# EAGLE design driver_ANNOTATED (EAGLE 8.0.0)
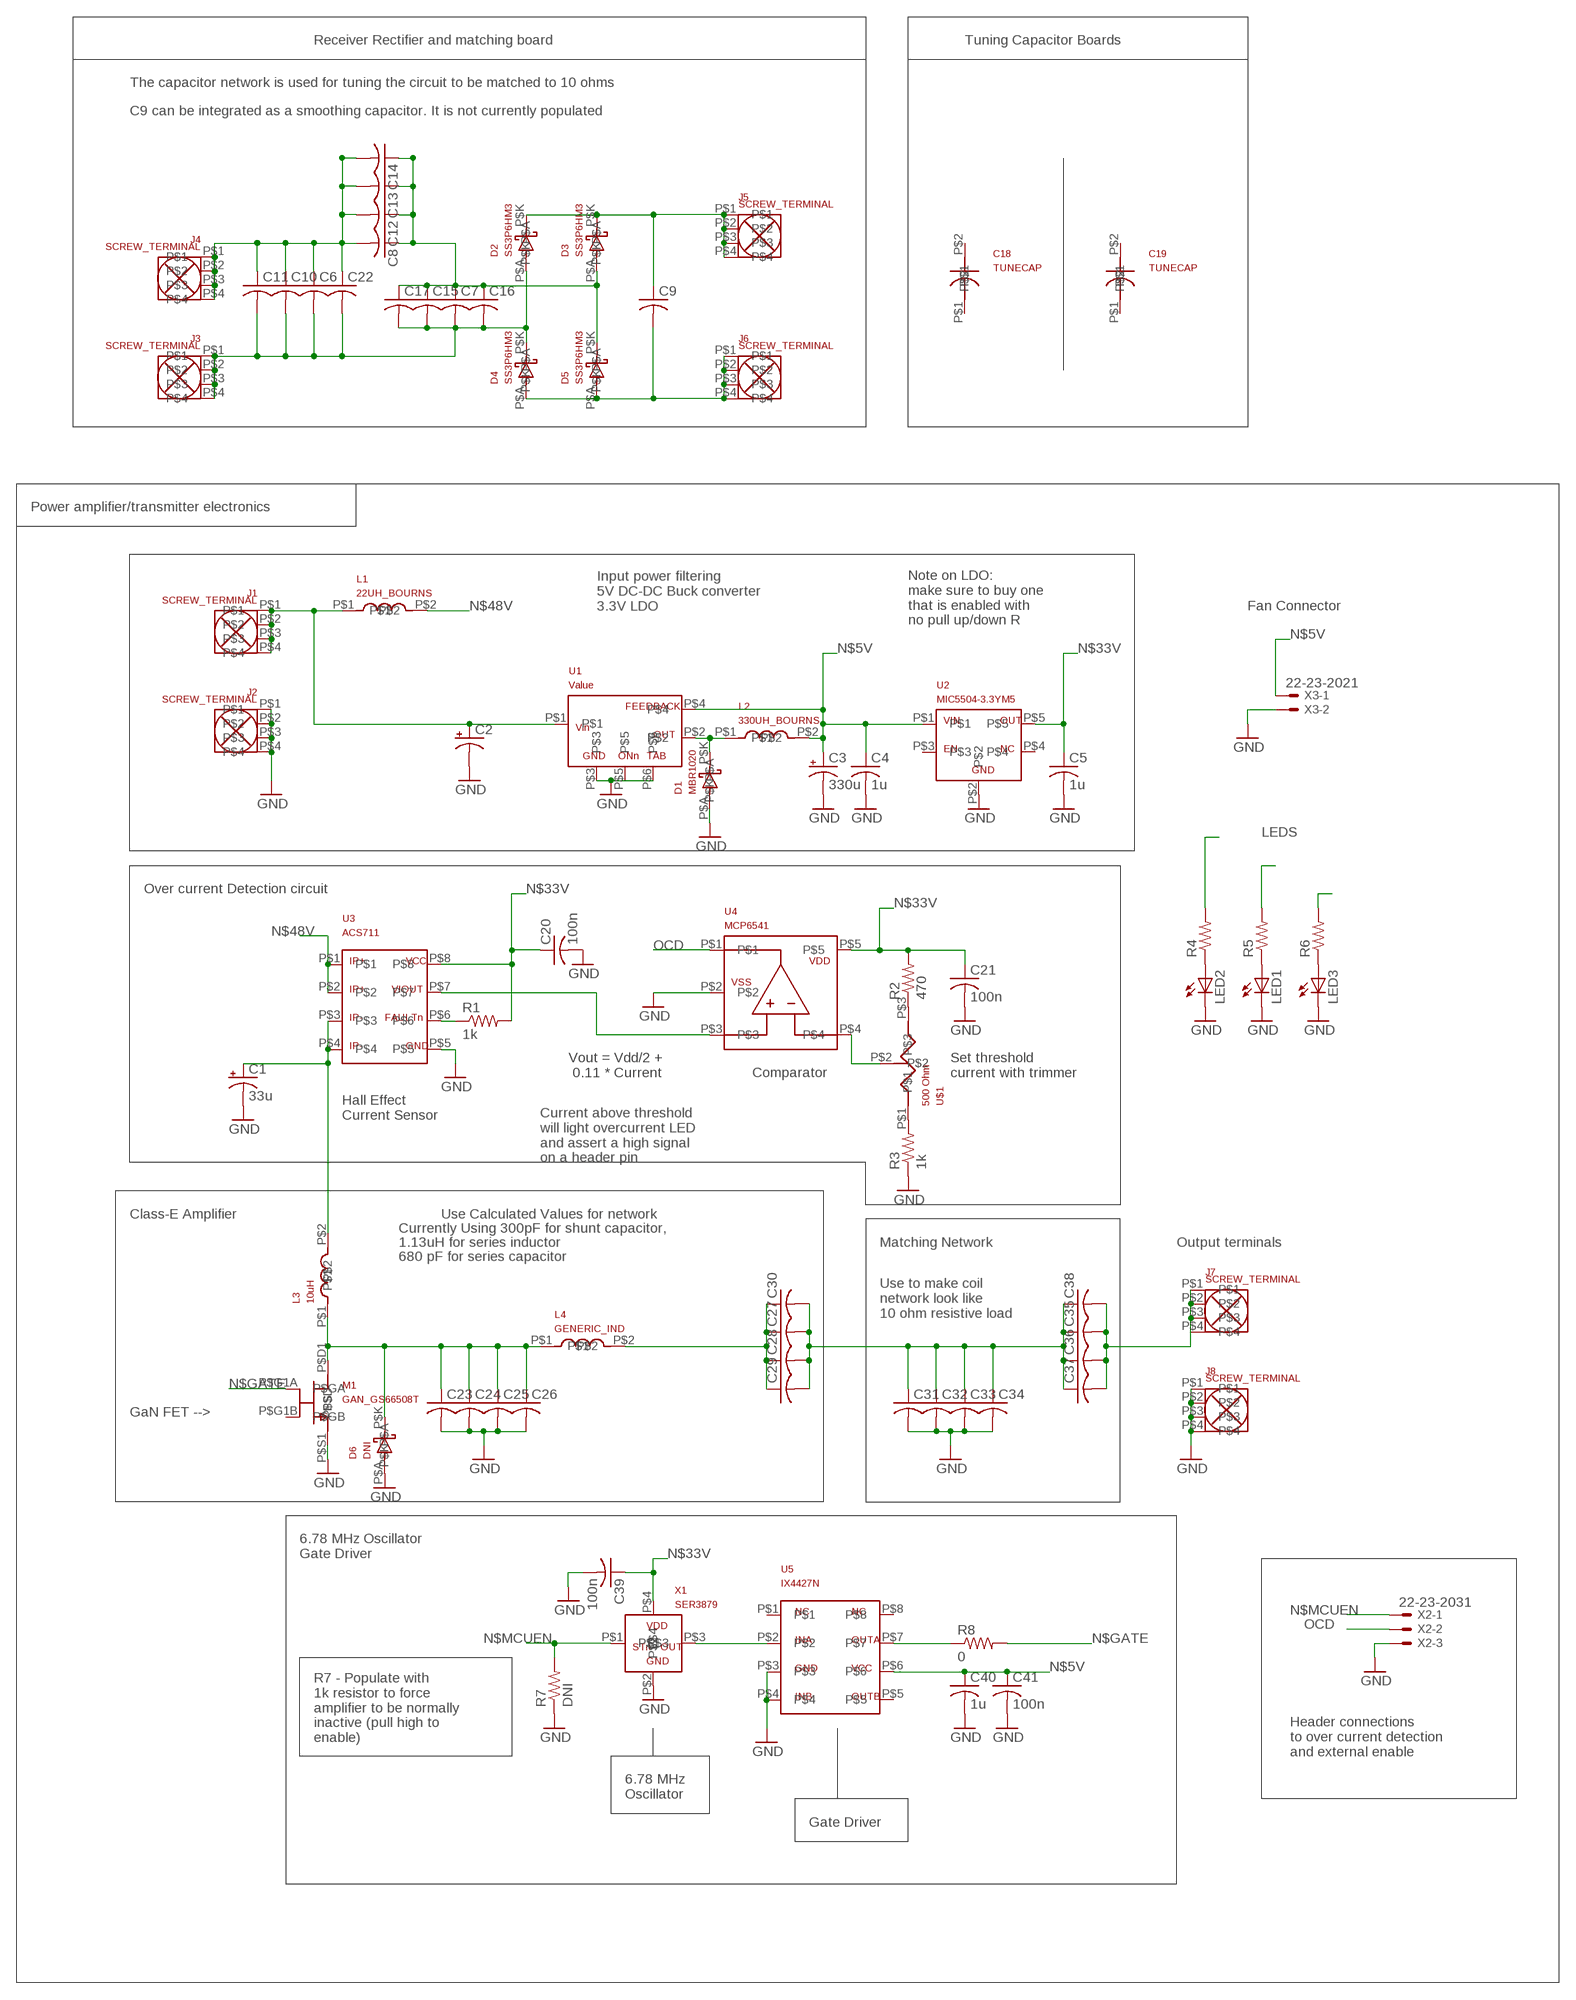
[diagram p0: schematic, sheet 1]

## Parts
C1  33u  CPOL-US140CLH-0810  [140CLH-0810]
C2  CPOL-US140CLH-1010  [140CLH-1010]
C3  330u  CPOL-US150CLZ-0810  [150CLZ-0810]
C4  1u  C-USC0603K  [C0603K]
C5  1u  C-USC0603K  [C0603K]
C6  C-USC1206K  [C1206K]
C7  C-USC1206K  [C1206K]
C8  C-USC1206K  [C1206K]
C9  C-USC1206K  [C1206K]
C10  C-USC1206K  [C1206K]
C11  C-USC1206K  [C1206K]
C12  C-USC1206K  [C1206K]
C13  C-USC1206K  [C1206K]
C14  C-USC1206K  [C1206K]
C15  C-USC1206K  [C1206K]
C16  C-USC1206K  [C1206K]
C17  C-USC1206K  [C1206K]
C18  TUNECAP  [CAPTUNE]
C19  TUNECAP  [CAPTUNE]
C20  100n  C-USC0603  [C0603]
C21  100n  C-USC0603K  [C0603K]
C22  C-USC1206K  [C1206K]
C23  C-USC1206K  [C1206K]
C24  C-USC1206K  [C1206K]
C25  C-USC1206K  [C1206K]
C26  C-USC1206K  [C1206K]
C27  C-USC1206K  [C1206K]
C28  C-USC1206K  [C1206K]
C29  C-USC1206K  [C1206K]
C30  C-USC1206K  [C1206K]
C31  C-USC1206K  [C1206K]
C32  C-USC1206K  [C1206K]
C33  C-USC1206K  [C1206K]
C34  C-USC1206K  [C1206K]
C35  C-USC1206K  [C1206K]
C36  C-USC1206K  [C1206K]
C37  C-USC1206K  [C1206K]
C38  C-USC1206K  [C1206K]
C39  100n  C-USC0603K  [C0603K]
C40  1u  C-USC0603K  [C0603K]
C41  100n  C-USC0603K  [C0603K]
D1  MBR1020  [SOD-123]
D2  SS3P6HM3  [D0-220]
D3  SS3P6HM3  [D0-220]
D4  SS3P6HM3  [D0-220]
D5  SS3P6HM3  [D0-220]
D6  DNI  SS3P6HM3  [D0-220]
J1  SCREW_TERMINAL  [SCREW_TERMINAL]
J2  SCREW_TERMINAL  [SCREW_TERMINAL]
J3  SCREW_TERMINAL  [SCREW_TERMINAL]
J4  SCREW_TERMINAL  [SCREW_TERMINAL]
J5  SCREW_TERMINAL  [SCREW_TERMINAL]
J6  SCREW_TERMINAL  [SCREW_TERMINAL]
J7  SCREW_TERMINAL  [SCREW_TERMINAL]
J8  SCREW_TERMINAL  [SCREW_TERMINAL]
L1  22UH_BOURNS  [492MIL_IND]
L2  330UH_BOURNS  [330U_IND]
L3  10uH  GENERIC_IND  [GENERIC_IND]
L4  GENERIC_IND  [GENERIC_IND]
LED1  LEDCHIPLED_0805  [CHIPLED_0805]
LED2  LEDCHIPLED_0805  [CHIPLED_0805]
LED3  LEDCHIPLED_0805  [CHIPLED_0805]
M1  GAN_GS66508T  [GAN_GS66508T]
R1  1k  R-US_R0603  [R0603]
R2  470  R-US_R0603  [R0603]
R3  1k  R-US_R0603  [R0603]
R4  R-US_R0603  [R0603]
R5  R-US_R0603  [R0603]
R6  R-US_R0603  [R0603]
R7  DNI  R-US_R0603  [R0603]
R8  0  R-US_R0603  [R0603]
U1  TL2575HV  [TL2575HV]
U2  MIC5504-3.3YM5  [MIC5504-3.3YM5]
U3  ACS711  [IX4427N]
U4  MCP6541  [SC-70-5]
U5  IX4427N  [IX4427N]
U$1  500 Ohm  TRIMMER  [TRIMMER]
X1  SER3879  [SER3879-ND]
X2  22-23-2031  [22-23-2031]
X3  22-23-2021  [22-23-2021]

## Nets
GND: C1.- C2.- C3.- C4.2 C5.2 C20.2 C21.2 C23.2 C24.2 C25.2 C26.2 C31.2 C32.2 C33.2 C34.2 C39.2 C40.2 C41.2 D1.P$A D6.P$A J2.P$1 J2.P$2 J2.P$3 J2.P$4 J8.P$1 J8.P$2 J8.P$3 J8.P$4 LED1.C LED2.C LED3.C M1.P$S1(P$S) R3.1 R7.1 U1.P$3 U1.P$5 U1.P$6 U2.P$2 U3.P$5 U4.P$2 U5.P$3 U5.P$4 X1.P$2 X2.3 X3.2
N$1: D1.P$K L2.P$1 U1.P$2
N$2: C2.+ J1.P$1 J1.P$2 J1.P$3 J1.P$4 L1.P$1 U1.P$1
N$3: C6.2 C7.2 C10.2 C11.2 C15.2 C16.2 C17.2 C22.2 D2.P$A D4.P$K J3.P$1 J3.P$2 J3.P$3 J3.P$4
N$4: C6.1 C8.2 C10.1 C11.1 C12.2 C13.2 C14.2 C22.1 J4.P$1 J4.P$2 J4.P$3 J4.P$4
N$5: C7.1 C8.1 C12.1 C13.1 C14.1 C15.1 C16.1 C17.1 D3.P$A D5.P$K
N$5V: C3.+ C4.1 C40.1 C41.1 L2.P$2 R4.2 U1.P$4 U2.P$1 U5.P$6 X3.1
N$6: C9.2 D4.P$A D5.P$A J6.P$1 J6.P$2 J6.P$3 J6.P$4
N$7: C9.1 D2.P$K D3.P$K J5.P$1 J5.P$2 J5.P$3 J5.P$4
N$8: C1.+ L3.P$2 U3.P$3 U3.P$4
N$9: U3.P$7 U4.P$3
N$10: R1.1 U3.P$6
N$11: R2.1 U$1.P$3
N$12: R3.2 U$1.P$1
N$14: U4.P$4 U$1.P$2
N$15: C23.1 C24.1 C25.1 C26.1 D6.P$K L3.P$1 L4.P$1 M1.P$D1(P$D)
N$16: C27.1 C28.1 C29.1 C30.1 L4.P$2
N$17: LED2.A R4.1
N$18: LED1.A R5.1
N$19: LED3.A R6.1
N$20: C27.2 C28.2 C29.2 C30.2 C31.1 C32.1 C33.1 C34.1 C35.1 C36.1 C37.1 C38.1
N$21: R8.1 U5.P$7
N$22: U5.P$2 X1.P$3
N$33V: C5.1 C20.1 C21.1 C39.1 R1.2 R2.2 U2.P$5 U3.P$8 U4.P$5 X1.P$4
N$36: C35.2 C36.2 C37.2 C38.2 J7.P$1 J7.P$2 J7.P$3 J7.P$4
N$48V: L1.P$2 U3.P$1 U3.P$2
N$GATE: M1.P$G1A(P$GA) R8.2
N$MCUEN: R6.2 R7.2 X1.P$1 X2.1
OCD: R5.2 U4.P$1 X2.2
Unconnected: C18.P$1 C18.P$2 C19.P$1 C19.P$2 M1.P$G1B(P$GB) U2.P$3 U2.P$4 U5.P$1 U5.P$5 U5.P$8

## Notes on the sheet
- Receiver Rectifier and matching board | Tuning Capacitor Boards
- The capacitor network is used for tuning the circuit to be matched to 10 ohms
- C9 can be integrated as a smoothing capacitor. It is not currently populated
- Power amplifier/transmitter electronics
- Input power filtering 
  5V DC-DC Buck converter
  3.3V LDO
- Fan Connector
- Note on LDO:
  make sure to buy one
  that is enabled with 
  no pull up/down R
- LEDS
- Over current Detection circuit
- Vout = Vdd/2 +
   0.11 * Current
- Comparator
- Set threshold 
  current with trimmer
- Hall Effect 
  Current Sensor
- Current above threshold
  will light overcurrent LED
  and assert a high signal
  on a header pin
- Class-E Amplifier | Use Calculated Values for network
- Currently Using 300pF for shunt capacitor,
- 1.13uH for series inductor | Matching Network | Output terminals
- 680 pF for series capacitor
- Use to make coil
  network look like
  10 ohm resistive load
- GaN FET -->
- 6.78 MHz Oscillator
  Gate Driver
- R7 - Populate with
  1k resistor to force
  amplifier to be normally
  inactive (pull high to 
  enable)
- Header connections
  to over current detection
  and external enable
- 6.78 MHz 
  Oscillator
- Gate Driver

## Library data of the parts
C1-C3 = rcl:CPOL-US: POLARIZED CAPACITOR, American symbol
C4-C17 C20-C41 = rcl:C-US: CAPACITOR, American symbol
C18 C19 = wpt:TUNECAP
D1 = wpt:MBR1020
D2-D6 = wpt:SS3P6HM3
J1-J8 = wpt:SCREW_TERMINAL
L1 = wpt:22UH_BOURNS
L2 = wpt:330UH_BOURNS
L3 L4 = wpt:GENERIC_IND
LED1-LED3 = led:LED: LED OSRAM: - CHIPLED LG R971, LG N971, LY N971, LG Q971, LY Q971, LO R971, LY R971 LH N974, LH R974 LS Q976, LO Q976, LY Q976 LO Q996 - Hyper CHIPLED LW Q18S LB Q993, LB Q99A, LB R99A - SideLED LS A670, LO A670, LY A670, LG A670, LP A670 LB A673, LV A673, LT A673, LW A673 LH A674 LY A675 LS A676, LA A676, LO A676, LY A676, LW A676 LS A679, LY A679, LG A679 - Hyper Micro SIDELED® LS Y876, LA Y876, LO Y876, LY Y876 LT Y87S - SmartLED LW L88C, LW L88S LB L89C, LB L89S, LG L890 LS L89K, LO L89K, LY L89K LS L896, LA L896, LO L896, LY L896 - TOPLED LS T670, LO T670, LY T670, LG T670, LP T670 LSG T670, LSP T670, LSY T670, LOP T670, LYG T670 LG T671, LOG T671, LSG T671 LB T673, LV T673, LT T673, LW T673 LH T674 LS T676, LA T676, LO T676, LY T676, LB T676, LH T676, LSB T676, LW T676 LB T67C, LV T67C, LT T67C, LS T67K, LO T67K, LY T67K, LW E67C LS E67B, LA E67B, LO E67B, LY E67B, LB E67C, LV E67C, LT E67C LW T67C LS T679, LY T679, LG T679 LS T770, LO T770, LY T770, LG T770, LP T770 LB T773, LV T773, LT T773, LW T773 LH T774 LS E675, LA E675, LY E675, LS T675 LS T776, LA T776, LO T776, LY T776, LB T776 LHGB T686 LT T68C, LB T68C - Hyper Mini TOPLED® LB M676 - Mini TOPLED Santana® LG M470 LS M47K, LO M47K, LY M47K Source: http://www.osram.convergy.de LUXEON: - LUMILED® LXK2-PW12-R00, LXK2-PW12-S00, LXK2-PW14-U00, LXK2-PW14-V00 LXK2-PM12-R00, LXK2-PM12-S00, LXK2-PM14-U00 LXK2-PE12-Q00, LXK2-PE12-R00, LXK2-PE12-S00, LXK2-PE14-T00, LXK2-PE14-U00 LXK2-PB12-K00, LXK2-PB12-L00, LXK2-PB12-M00, LXK2-PB14-N00, LXK2-PB14-P00, LXK2-PB14-Q00 LXK2-PR12-L00, LXK2-PR12-M00, LXK2-PR14-Q00, LXK2-PR14-R00 LXK2-PD12-Q00, LXK2-PD12-R00, LXK2-PD12-S00 LXK2-PH12-R00, LXK2-PH12-S00 LXK2-PL12-P00, LXK2-PL12-Q00, LXK2-PL12-R00 Source: www.luxeon.com KINGBRIGHT: KA-3528ASYC Source: www.kingbright.com
M1 = wpt:GAN_GS66508T
R1-R8 = rcl:R-US_: RESISTOR, American symbol
U1 = wpt:TL2575HV
U2 = wpt:MIC5504-3.3YM5
U3 = wpt:ACS711
U4 = wpt:MCP6541
U5 = wpt:IX4427N
U$1 = wpt:TRIMMER
X1 = wpt:SER3879
X2 = con-molex:22-23-2031: .100" (2.54mm) Center Header - 3 Pin; MF: MOLEX; MPN: 22-23-2031; OC_FARNELL: 1462950; OC_NEWARK: 30C0862
X3 = con-molex:22-23-2021: .100" (2.54mm) Center Header - 2 Pin; MF: MOLEX; MPN: 22-23-2021; OC_FARNELL: 1462926; OC_NEWARK: 25C3832

## Board
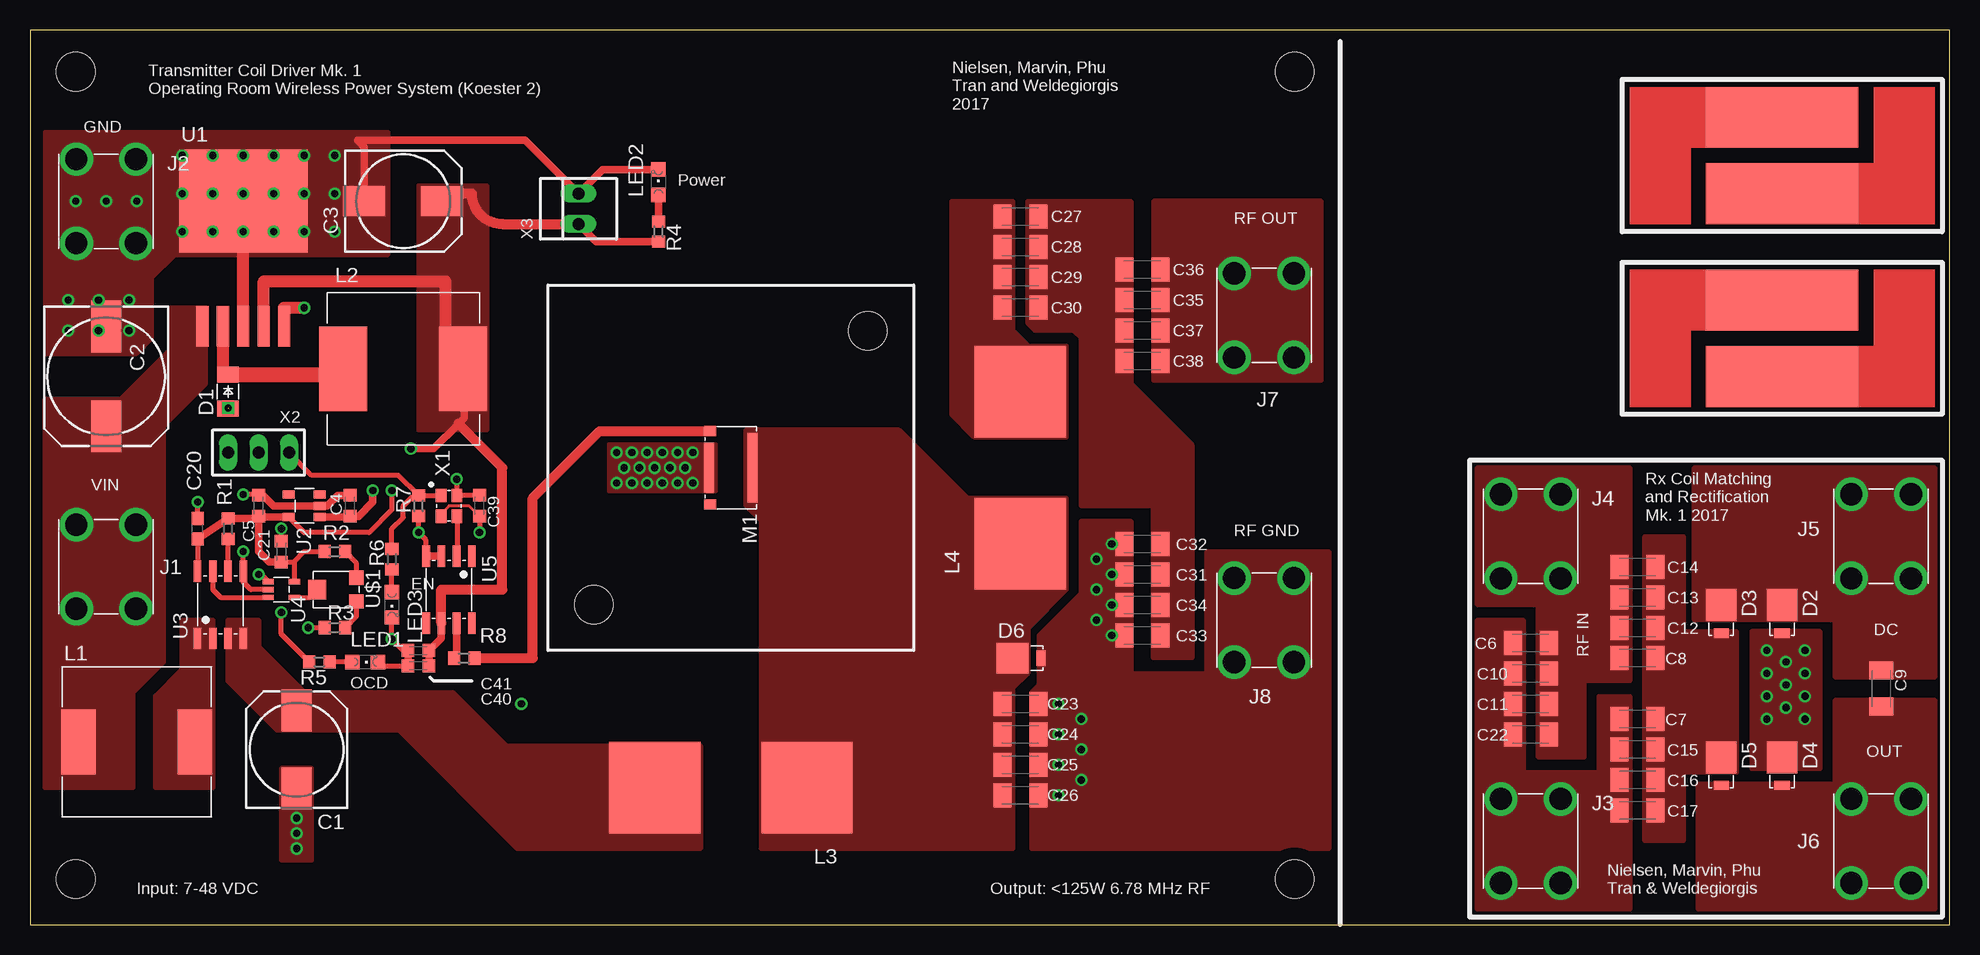
[diagram p1: board, top side]
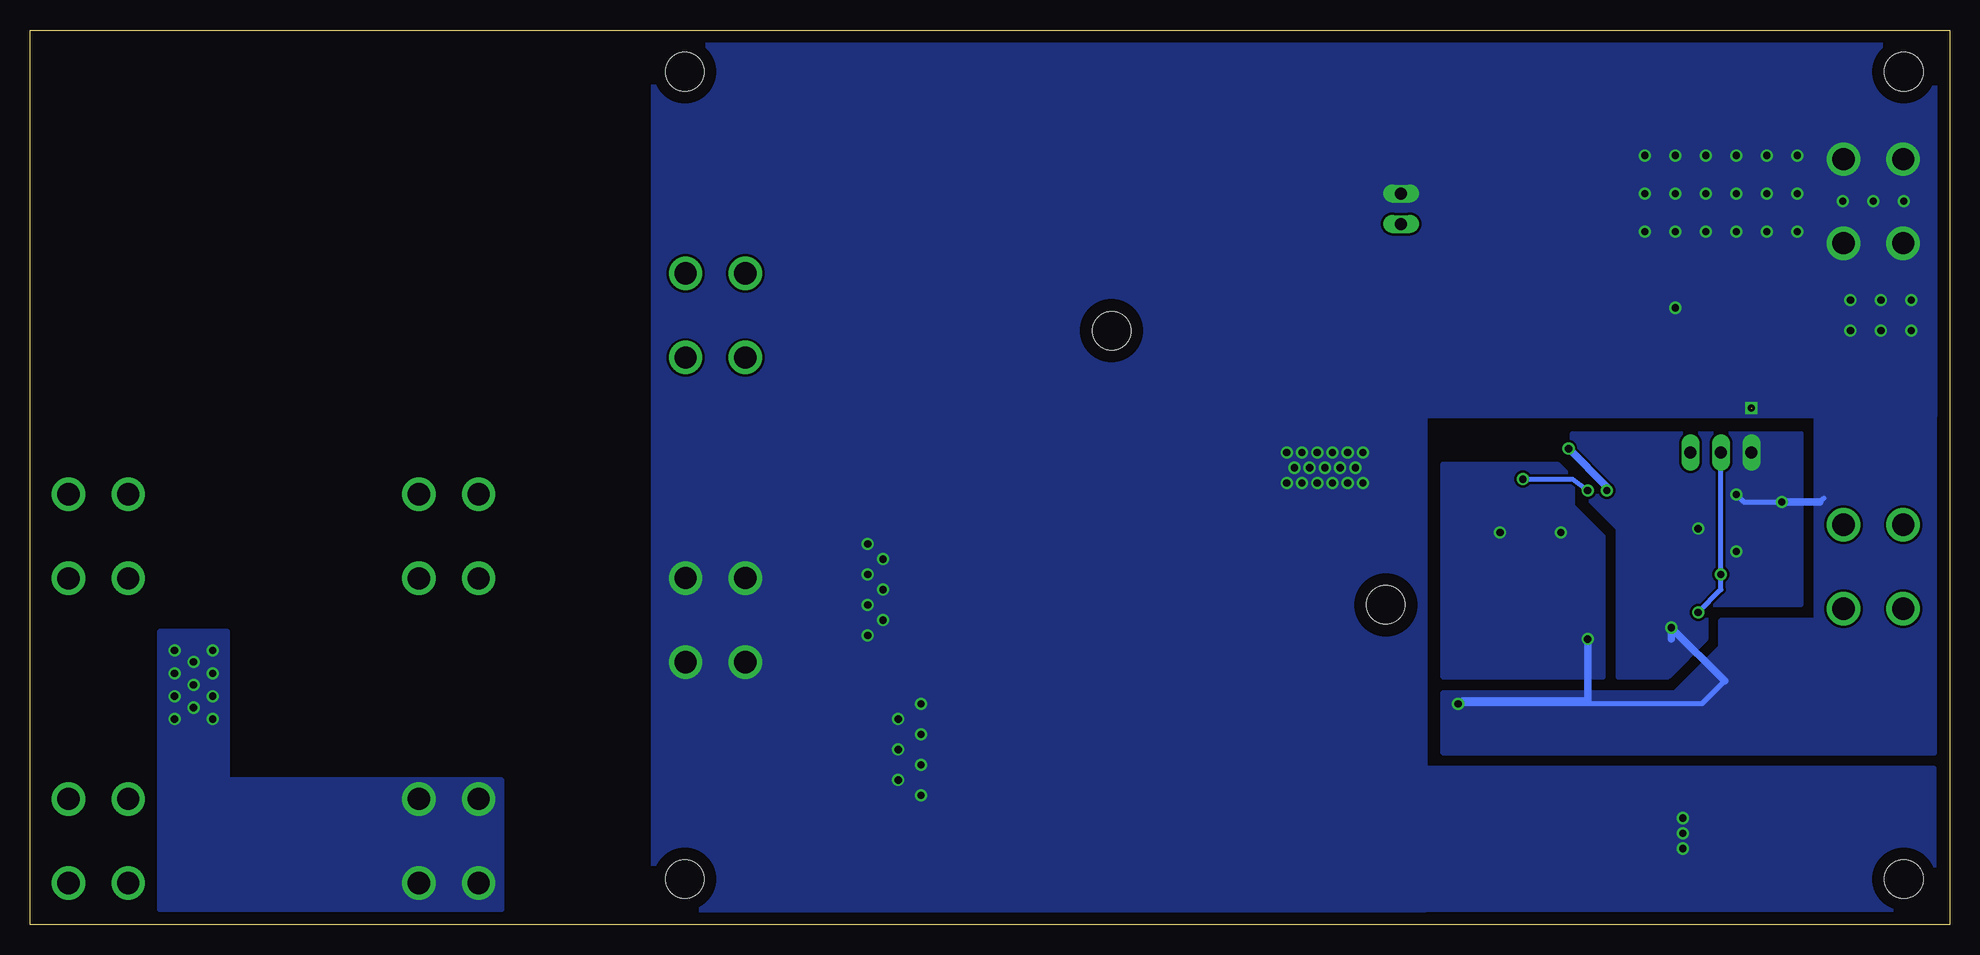
[diagram p2: board, bottom side, seen from below]

Size 160 x 74.6 mm. Coordinates in mm from the lower left corner, seen from the top.
Outline: 0,0 160,0 160,74.6 0,74.6 0,0
Copper layers (1*16): Top 0.035mm / dielectric 1.5mm / Bottom 0.035mm
Design rules "default": minimum track width 10mil, minimum drill 24mil, track to track 8mil, track to pad 8mil, pad to pad 8mil, via to via 8mil, smd to smd 8mil, copper to edge 40mil, drill to drill 8mil, minimum pad ring 10mil, minimum via ring 8mil, stop-mask expansion 4mil, vias tented up to drill 0mil, thermal gap 10mil
Holes 3.2 mm at 3.81,3.81 3.81,71.12 46.99,26.67 69.85,49.53 105.41,3.81 105.41,71.12

### Footprints (pad centres in the part's own frame; a part is rotated, then mirrored left to right if it is on the bottom)
140CLH-0810 = smd 3.5 x 2.5: + 3.25,0; - -3.25,0
140CLH-1010 = smd 4.3 x 2.5: + 4.15,0; - -4.15,0
150CLZ-0810 = smd 3.5 x 2.5: + 3.25,0; - -3.25,0
C0603K = smd 1.05 x 1.08: 1 -0.875,0; 2 0.875,0
C1206K = smd 1.5 x 2: 1 -1.5,0; 2 1.5,0
CAPTUNE = smd 12.7 x 5.08: P$1 0,3.81; P$2 0,-2.54
C0603 = smd 1.1 x 1: 1 -0.85,0; 2 0.85,0
SOD-123 = smd 1.346 x 1.803: P$A -1.422,0; P$K 1.422,0
D0-220 = smd 0.762 x 1.27: P$A 2.362,0 | smd 2.667 x 2.54: P$K 0,0
SCREW_TERMINAL = drill 1.854: P$1 -2.489,3.505; P$2 2.489,3.505; P$3 2.489,-3.505; P$4 -2.489,-3.505
492MIL_IND = smd 2.896 x 5.41: P$1 -4.851,0; P$2 4.851,0
330U_IND = smd 3.988 x 7.01: P$1 -5.004,0; P$2 5.004,0
GENERIC_IND = smd 7.62 x 7.62: P$1 -6.35,0; P$2 6.35,0
CHIPLED_0805 = smd 1.2 x 1.2: A 0,-1.05; C 0,1.05
GAN_GS66508T = smd 5.817 x 0.838: P$D1 0,1.803 | smd 0.838 x 0.991: P$G1A -3.048,-1.727; P$G1B 3.048,-1.727 | smd 4.242 x 0.838: P$S1 0,-1.803
R0603 = smd 1 x 1.1: 1 -0.85,0; 2 0.85,0
TL2575HV = smd 1.016 x 3.404: P$1 -3.404,-10.439; P$2 -1.702,-10.439; P$3 0,-10.439; P$4 1.702,-10.439; P$5 3.404,-10.439 | smd 10.693 x 8.585: P$6 0,0
MIC5504-3.3YM5 = smd 0.66 x 1.016: P$1 0.94,1.295; P$2 0,1.295; P$3 -0.94,1.295; P$4 -0.94,-1.295; P$5 0.94,-1.295
IX4427N = smd 0.635 x 1.778: P$1 1.905,2.794; P$2 0.635,2.794; P$3 -0.635,2.794; P$4 -1.905,2.794; P$5 -1.905,-2.794; P$6 -0.635,-2.794; P$7 0.635,-2.794; P$8 1.905,-2.794
SC-70-5 = smd 0.432 x 0.94: P$1 0.66,1.092; P$2 0,1.092; P$3 -0.66,1.092; P$4 -0.66,-1.092; P$5 0.66,-1.092
TRIMMER = smd 1.194 x 1.194: P$1 -0.991,-1.803; P$3 0.991,-1.803 | smd 1.6 x 1.499: P$2 0,1.448
SER3879-ND = smd 1.092 x 0.889: P$1 -0.864,-0.66; P$2 0.864,-0.66; P$3 0.864,0.66; P$4 -0.864,0.66
22-23-2031 = drill 1 long: 1 -2.54,0; 2 0,0; 3 2.54,0
22-23-2021 = drill 1 long: 1 -1.27,0; 2 1.27,0

### Placement (x,y rotation side)
C1  22.23,14.61 90 top
C2  6.35,45.72 270 top
C3  31.11,60.33 0 top
C4  26.67,34.92 90 top
C5  19.05,34.92 90 top
C6  125.09,20.95 180 top
C7  133.99,17.14 180 top
C8  133.99,22.23 180 top
C9  154.31,19.68 270 top
C10  125.09,15.88 180 top
C11  125.09,18.41 180 top
C12  133.99,24.77 180 top
C13  133.99,27.3 180 top
C14  133.99,29.84 180 top
C15  133.99,14.61 180 top
C16  133.99,12.06 180 top
C17  133.99,9.53 180 top
C18  146.05,64.77 180 top
C19  146.05,49.53 180 top
C20  13.97,33.02 90 top
C21  20.95,31.11 90 top
C22  125.09,23.5 180 top
C23  82.55,18.41 0 top
C24  82.55,15.88 0 top
C25  82.55,13.34 0 top
C26  82.55,10.79 0 top
C27  82.55,59.05 0 top
C28  82.55,56.52 0 top
C29  82.55,53.98 0 top
C30  82.55,51.44 0 top
C31  92.71,29.21 180 top
C32  92.71,31.75 180 top
C33  92.71,24.13 180 top
C34  92.71,26.67 180 top
C35  92.71,52.07 0 top
C36  92.71,54.61 0 top
C37  92.71,49.53 0 top
C38  92.71,46.99 0 top
C39  37.47,34.92 270 top
C40  32.38,21.59 180 top
C41  32.38,22.86 180 top
D1  16.51,44.45 90 top
D2  146.05,26.67 270 top
D3  140.97,26.67 270 top
D4  146.05,13.97 270 top
D5  140.97,13.97 270 top
D6  81.92,22.23 0 top
J1  6.35,29.84 0 top
J2  6.35,60.33 0 top
J3  125.09,6.99 0 top
J4  125.09,32.38 0 top
J5  154.31,32.38 0 top
J6  154.31,6.99 0 top
J7  102.87,50.8 0 top
J8  102.87,25.4 0 top
L1  8.89,15.24 0 top
L2  31.11,46.35 0 top
L3  58.42,11.43 180 top
L4  82.55,38.1 90 top
LED1  27.94,21.91 270 top
LED2  52.39,61.91 0 top
LED3  30.16,26.67 180 top
M1  58.42,38.1 270 top
R1  16.51,33.02 90 top
R2  25.4,31.11 180 top
R3  25.4,24.77 0 top
R4  52.39,57.78 270 top
R5  24.13,21.91 180 top
R6  30.16,30.48 90 top
R7  32.38,34.92 90 top
R8  36.2,22.23 0 top
U1  17.78,60.33 0 top
U2  22.86,34.92 270 top
U3  15.88,26.67 180 top
U4  20.95,27.94 90 top
U5  34.92,27.94 0 top
U$1  25.4,27.94 90 top
X1  34.92,34.92 270 top
X2  19.05,39.37 180 top
X3  45.72,59.69 90 top

### Tracks (layer width: path | path; a pad name or v marks a point on that pad's centre or on a via)
GND  (via drill 0.6)  (1 unrouted)
  Top 0.254: C39.2 36.59,34.92 34.92,34.92 34.27,34.27 X1.P$2
  Top 0.406: U4.P$2 18.41,27.94 17.78,28.57 U3.P$5 v17.78,31.11 | R7.1 32.4,34.06 32.38,34.05 v32.38,32.7 33.02,32.07 U5.P$4 | LED1.C 29.31,21.59 C40.2 | C39.2 v37.47,32.7 | LED3.C v30.16,23.81 31.11,22.86 C41.2 | C5.2 arc90 18.97,35.88 v17.78,35.88 | R3.1 v23.18,24.77 | C21.2 v20.95,33.02 | C20.2 v13.97,35.24
  Top 0.61: C4.2 25.64,35.8 24.77,34.92 U2.P$2 20.32,34.92 19.45,35.8 C5.2 | U5.P$3 U5.P$4 | C40.2 C41.2 | LED2.C 47.72,62.96 X3.2 41.27,65.41 27.3,65.41 27.86,64.84 C3.-
  Top 1.016: U1.P$3 v17.78,57.78 U1.P$6 | U1.P$5 21.18,51.44 v22.86,51.44
  Bottom 0.406: v13.97,35.24 17.14,35.24 v17.78,35.88 | 10.79,35.24 10.48,35.56 | 30.16,18.73 40.64,18.73 v40.96,18.41 20.64,18.41 18.73,20.32
  Bottom 0.61: 23.18,23.81 v23.18,24.77 18.73,20.32 | v13.97,35.24 10.79,35.24 | v30.16,23.81 30.16,18.73
  other vias: 48.9,39.37 50.16,39.37 51.44,39.37 52.7,39.37 53.98,39.37 55.24,39.37 49.53,38.1 50.8,38.1 52.07,38.1 53.34,38.1 54.61,38.1 55.24,36.83 53.98,36.83 52.7,36.83 51.44,36.83 50.16,36.83 48.9,36.83 22.23,8.89 22.23,7.62 22.23,6.35 90.17,31.75 88.9,30.48 90.17,29.21 88.9,27.94 90.17,26.67 88.9,25.4 90.17,24.13 3.17,52.07 5.71,52.07 8.26,52.07 8.26,49.53 5.71,49.53 3.17,49.53 3.81,60.33 6.35,60.33 8.89,60.33 12.7,64.14 15.24,64.14 17.78,64.14 20.32,64.14 22.86,64.14 25.4,64.14 25.4,60.96 25.4,57.78 22.86,57.78 20.32,57.78 15.24,57.78 12.7,57.78 12.7,60.96 15.24,60.96 17.78,60.96 20.32,60.96 22.86,60.96 87.63,12.06 85.72,10.79 85.72,13.34 87.63,14.61 85.72,15.88 87.63,17.14 85.72,18.41 16.51,43.08
  pour Top (no thermals): 57.15,40.01 48.26,40.01 48.26,36.2 57.15,36.2
  pour Top (no thermals): 84.14,20 84.14,24.13 87.63,27.62 87.63,33.66 91.76,33.66 91.76,20.95 98.11,20.95 98.11,31.11 108.27,31.11 108.27,6.35 83.5,6.35 83.5,19.37
  pour Top (no thermals): 1.27,47.62 8.89,47.62 10.16,48.9 10.16,53.98 12.06,55.88 29.84,55.88 29.84,66.04 1.27,66.04
  pour Bottom (no thermals): 1.27,73.66 1.27,42.55 43.81,42.55 43.81,1.27 107.95,1.27 107.95,73.66
  pour Bottom (no thermals): 42.23,38.42 32.7,38.42 31.43,37.15 31.43,34.92 28.89,32.38 28.89,20.64 41.59,20.64 42.23,20.64
  pour Bottom (no thermals): 27.62,20.64 27.62,33.02 30.16,35.56 30.16,37.15 31.43,38.42 31.43,40.96 12.38,40.96 12.38,26.67 20.32,26.67 20.32,23.81 23.5,20.64
  pour Top (no thermals): 20.95,13.02 20.95,5.4 23.5,5.4 23.5,13.02
  pour Bottom (no thermals): 43.81,1.27 1.27,1.27 1.27,13.02 43.81,13.02
  pour Bottom (no thermals): 1.27,42.55 1.27,14.29 42.23,14.29 42.23,19.37 23.81,19.37 22.86,19.37 19.05,23.18 19.05,25.4 11.11,25.4 11.11,42.55
N$1
  Top 1.016: U1.P$2 16.08,46.3 D1.P$K
  Top 1.27: D1.P$K 26.52,45.87 26.67,45.72 26.67,45.8 L2.P$1
N$2
  Top 1.016: U1.P$1 14.38,49.87
  pour Top (no thermals): 1.27,43.81 7.62,43.81 11.75,47.94 11.75,51.44 14.61,51.44 14.61,45.09 11.11,41.59 11.11,21.91 8.57,19.37 8.57,11.43 1.27,11.43
N$3  (via drill 0.6)
  other vias: 144.78,17.14 147.96,17.14 146.37,18.1 144.78,19.05 147.96,19.05 146.37,20 144.78,20.95 146.37,21.91 147.96,20.95 147.96,22.86 144.78,22.86
  pour Top (no thermals): 120.65,25.4 124.46,25.4 124.46,12.7 130.81,12.7 130.81,19.05 133.35,19.05 133.35,1.27 120.65,1.27
  pour Bottom (no thermals): 120.65,1.27 120.65,12.06 143.51,12.06 143.51,24.45 149.22,24.45 149.22,1.27
  pour Top (no thermals): 143.51,13.02 149.22,13.02 149.22,24.45 143.51,24.45
N$4
  pour Top (no thermals): 125.73,13.97 125.73,26.67 120.65,26.67 120.65,38.1 133.35,38.1 133.35,20.32 129.54,20.32 129.54,13.97
N$5
  pour Top (no thermals): 134.62,6.99 134.62,32.38 137.79,32.38 137.79,24.45 142.24,24.45 142.24,12.7 137.79,12.7 137.79,6.99
N$5V  (via drill 0.6)
  Top 0.61: U2.P$1 26.61,33.98 C4.1 27.38,34.05 28.57,35.24 v28.57,36.2 | C40.1 C41.1 34.29,23.89 U5.P$6 | v31.75,39.69 33.66,39.69 35.72,41.75 36.2,42.23 36.2,44.45 36.2,46.28 L2.P$2 | X3.1 47.2,56.94 R4.2
  Top 0.813: X3.1 39.37,58.42 arc-90 36.83,60.96 35,60.96 arc90 C3.+ | U5.P$6 34.29,27.94 39.37,27.94 39.37,38.1 35.72,41.75
  Top 1.016: U1.P$4 19.48,53.66 34.61,53.66 34.61,44.45 36.2,44.45
  Bottom 0.61: v28.57,36.2 28.57,36.51 v31.75,39.69
  pour Top (no thermals): 32.38,61.59 32.38,41.27 38.1,41.27 38.1,61.59
N$6
  pour Top (no thermals): 139.06,11.75 150.5,11.75 150.5,18.73 158.75,18.73 158.75,1.27 140.02,1.27 139.06,1.27
N$7
  pour Top (no thermals): 158.75,20.64 150.5,20.64 150.5,25.4 138.75,25.4 138.75,38.1 158.75,38.1
N$8
  pour Top (no thermals): 16.51,20.32 16.51,25.4 19.05,25.4 19.05,23.18 22.86,19.37 35.24,19.37 39.69,14.92 55.88,14.92 55.88,6.35 40.64,6.35 30.8,16.19 20.64,16.19
N$9
  Top 0.406: U3.P$7 15.24,27.94 15.88,27.3 19.84,27.3 U4.P$3
N$10
  Top 0.406: U3.P$6 R1.1
N$11
  Top 0.406: R2.1 27.2,30.16 U$1.P$3
N$12
  Top 0.406: U$1.P$1 27.2,25.72 R3.2
N$14
  Top 0.406: U4.P$4 23.29,27.28 U$1.P$2
N$15
  pour Top (no thermals): 60.96,6.35 60.96,33.66 59.69,34.92 59.69,41.27 60.33,41.27 72.39,41.27 78.11,35.56 86.36,35.56 86.36,27.94 83.19,24.77 83.19,20.95 81.92,19.68 81.92,6.35
N$16
  pour Top (no thermals): 78.74,40.64 76.83,42.55 76.83,59.69 76.83,60.33 81.92,60.33 81.92,49.53 83.19,48.26 86.36,48.26 86.36,40.64
N$17
  Top 0.61: R4.1 LED2.A
N$18
  Top 0.406: LED1.A R5.1
N$19
  Top 0.406: LED3.A R6.1
N$20
  pour Top (no thermals): 93.66,22.23 93.66,34.92 87.63,34.92 87.63,48.9 87,49.53 83.82,49.53 83.19,50.16 83.19,60.33 91.76,60.33 91.76,45.09 96.84,40.01 96.84,22.23
N$21
  Top 0.61: U5.P$7 35.56,22.44 arc-90 R8.1
N$22
  Top 0.406: X1.P$3 35.59,30.76 U5.P$2
  Top 0.61: 35.56,34.04 X1.P$3
N$33V  (via drill 0.6)
  Top 0.406: C20.1 U3.P$8 | C39.1 37.45,35.79 X1.P$4 35.59,37.12 v35.56,37.15 | U4.P$5 22.05,30.3 | 22.05,30.3 22.86,31.11 R2.2 | 22.05,30.3 21.98,30.24 C21.1 | v30.16,36.2 30.16,34.61 28.26,32.7 22.85,32.7 U2.P$5
  Top 0.61: U2.P$5 19.11,33.98 arc-90 C5.1 | C5.1 18.87,33.87 R1.2 C20.1 | C5.1 19.05,31.11 19.93,30.24 C21.1
  Bottom 0.406: v35.56,37.15 31.43,37.15 v30.16,36.2
N$36
  pour Top (no thermals): 93.66,60.33 93.66,45.4 107.63,45.4 107.63,60.33
N$48V
  pour Top (no thermals): 14.92,11.43 10.48,11.43 10.48,19.05 12.7,21.27 12.7,25.4 15.24,25.4 15.24,11.43
N$GATE
  Top 0.813: R8.2 41.91,22.23 41.91,35.56 47.5,41.15 M1.P$G1A
N$MCUEN
  Top 0.406: R7.2 32.4,35.79 X1.P$1 | R7.2 30.7,37.47 23.5,37.47 X2.1 | R6.2 30.16,33.02 31.11,33.97 31.11,34.92 31.75,35.56 arc-53 R7.2
OCD  (via drill 0.6)
  Top 0.406: U4.P$1 19.25,29.21 v19.05,29.21 | R5.2 20.95,24.23 v20.95,26.04
  Bottom 0.406: X2.2 v19.05,29.21 19.05,27.94 v20.95,26.04

### Text on the board
tPlace: Transmitter Coil Driver Mk. 1 / Operating Room Wireless Power System (Koester 2) | Nielsen, Marvin, Phu / Tran and Weldegiorgis / 2017 | GND | Power | RF OUT | VIN | Rx Coil Matching / and Rectification / Mk. 1 2017 | RF GND | EN | RF IN | DC | OCD | OUT | Input: 7-48 VDC | Output: <125W 6.78 MHz RF | Nielsen, Marvin, Phu / Tran & Weldegiorgis